# EAGLE design Adafruit_NeoMatrix_8x8 (EAGLE 6.4)
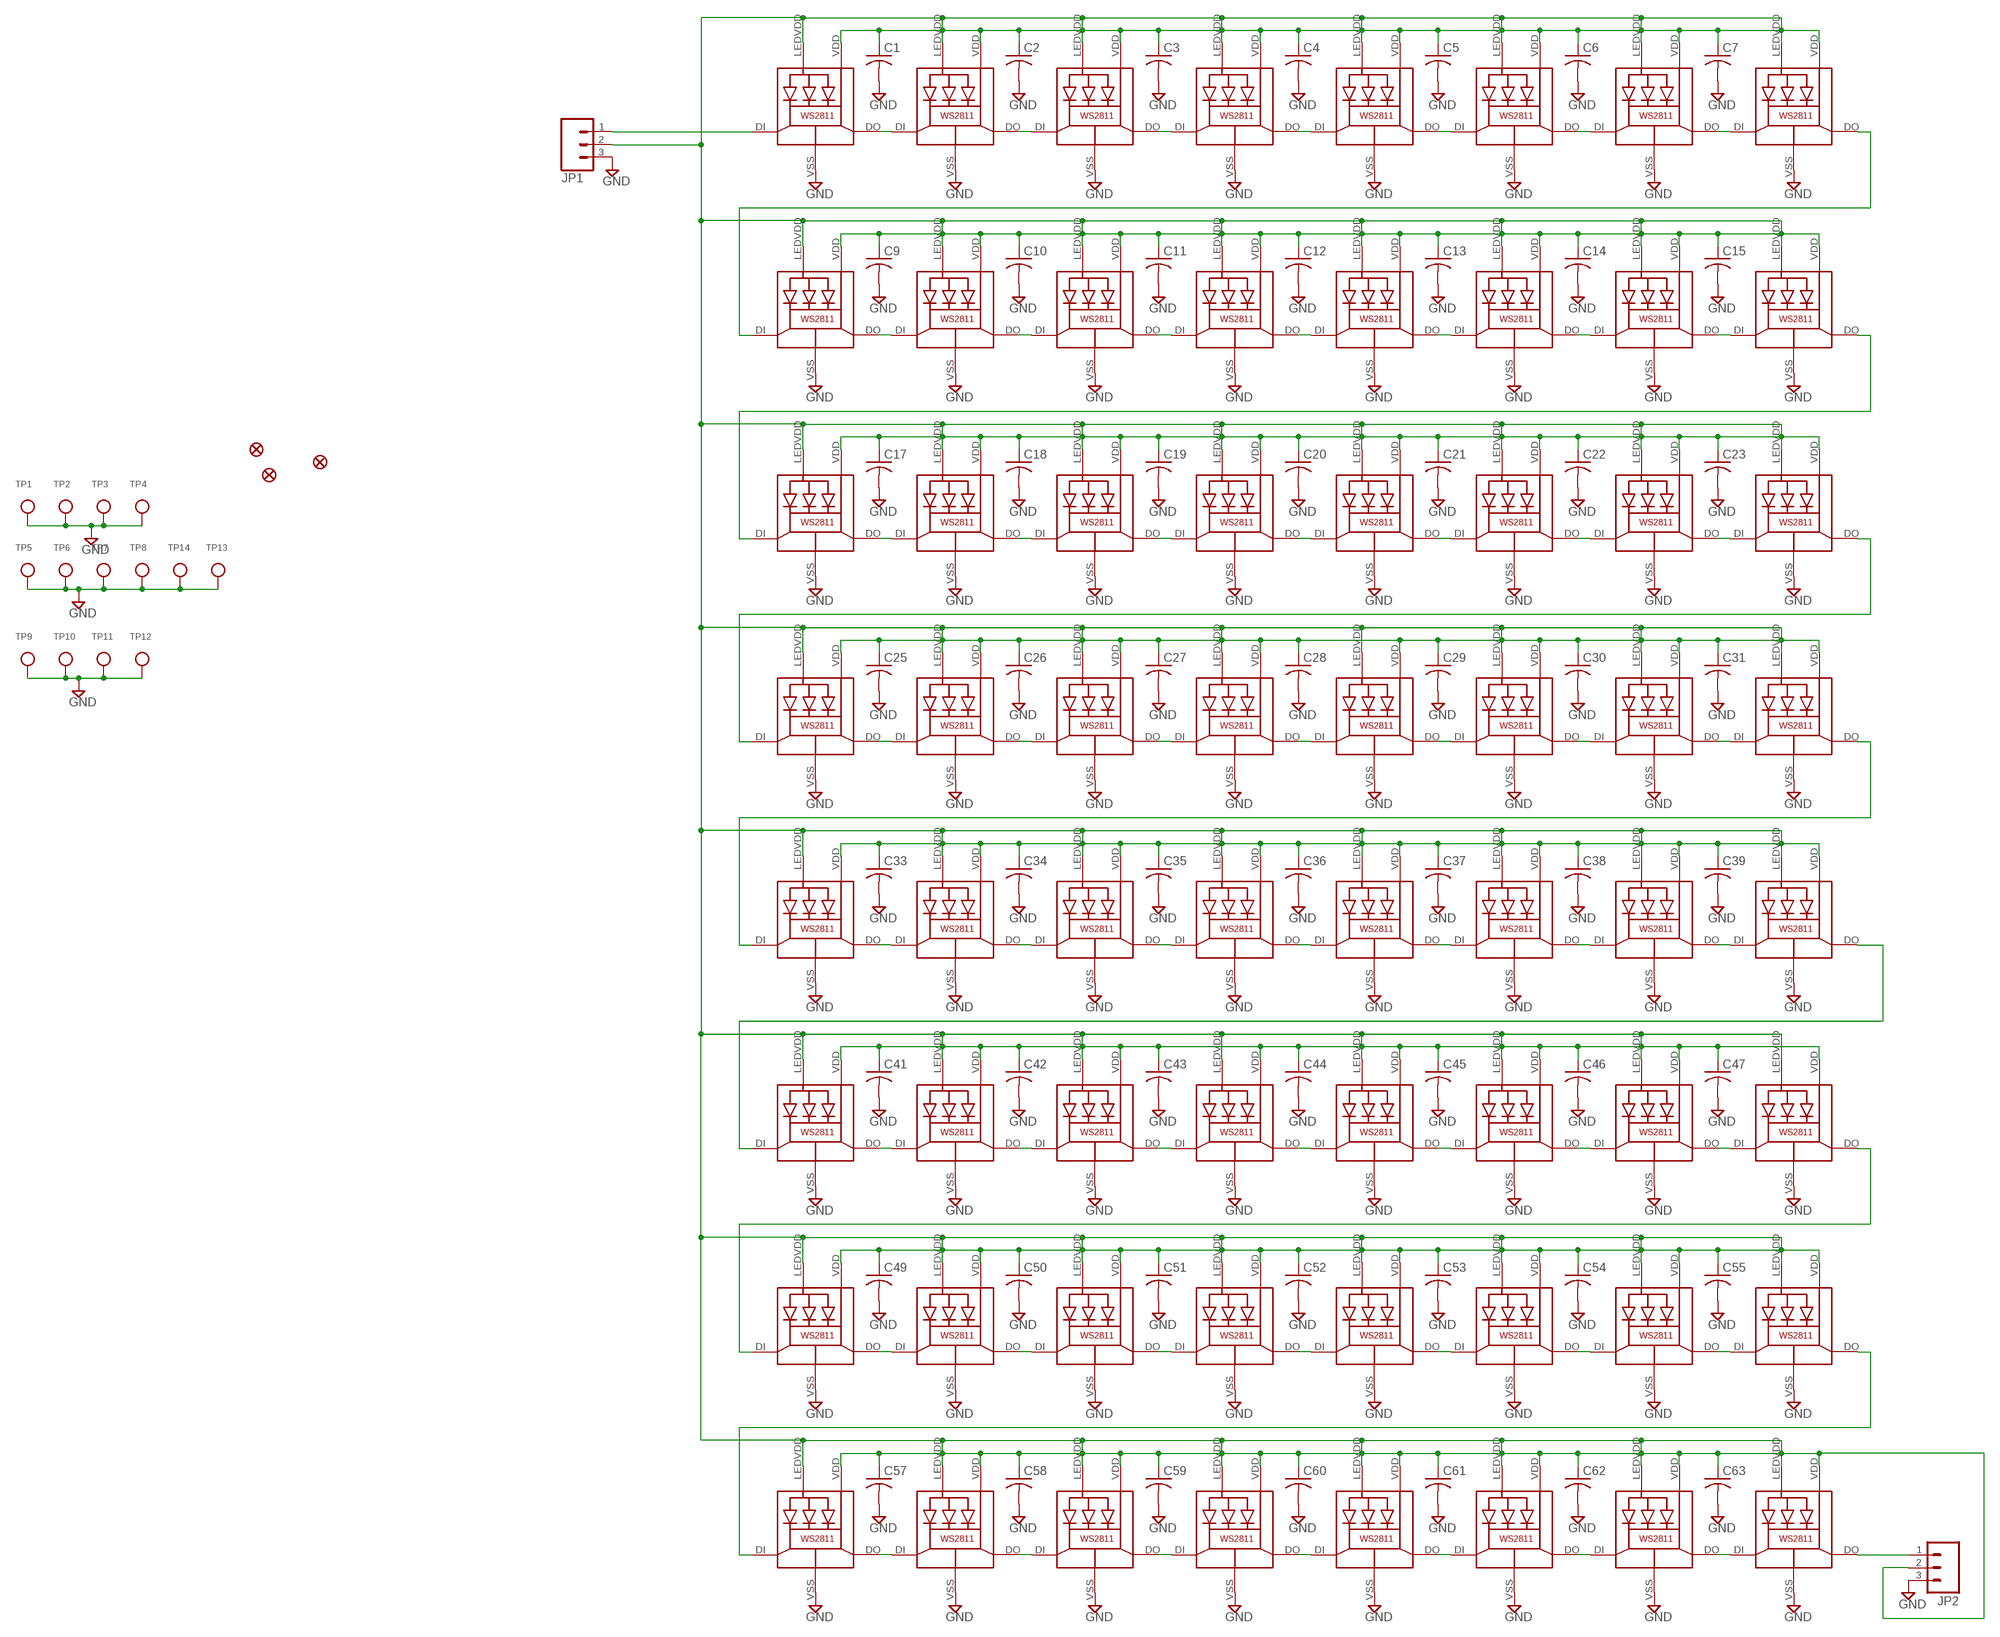
[diagram p0: schematic, sheet 1]

## Parts
C1  RCL_C-USC0805K  [RCL_C0805K]
C2  RCL_C-USC0805K  [RCL_C0805K]
C3  RCL_C-USC0805K  [RCL_C0805K]
C4  RCL_C-USC0805K  [RCL_C0805K]
C5  RCL_C-USC0805K  [RCL_C0805K]
C6  RCL_C-USC0805K  [RCL_C0805K]
C7  RCL_C-USC0805K  [RCL_C0805K]
C9  RCL_C-USC0805K  [RCL_C0805K]
C10  RCL_C-USC0805K  [RCL_C0805K]
C11  RCL_C-USC0805K  [RCL_C0805K]
C12  RCL_C-USC0805K  [RCL_C0805K]
C13  RCL_C-USC0805K  [RCL_C0805K]
C14  RCL_C-USC0805K  [RCL_C0805K]
C15  RCL_C-USC0805K  [RCL_C0805K]
C17  RCL_C-USC0805K  [RCL_C0805K]
C18  RCL_C-USC0805K  [RCL_C0805K]
C19  RCL_C-USC0805K  [RCL_C0805K]
C20  RCL_C-USC0805K  [RCL_C0805K]
C21  RCL_C-USC0805K  [RCL_C0805K]
C22  RCL_C-USC0805K  [RCL_C0805K]
C23  RCL_C-USC0805K  [RCL_C0805K]
C25  RCL_C-USC0805K  [RCL_C0805K]
C26  RCL_C-USC0805K  [RCL_C0805K]
C27  RCL_C-USC0805K  [RCL_C0805K]
C28  RCL_C-USC0805K  [RCL_C0805K]
C29  RCL_C-USC0805K  [RCL_C0805K]
C30  RCL_C-USC0805K  [RCL_C0805K]
C31  RCL_C-USC0805K  [RCL_C0805K]
C33  RCL_C-USC0805K  [RCL_C0805K]
C34  RCL_C-USC0805K  [RCL_C0805K]
C35  RCL_C-USC0805K  [RCL_C0805K]
C36  RCL_C-USC0805K  [RCL_C0805K]
C37  RCL_C-USC0805K  [RCL_C0805K]
C38  RCL_C-USC0805K  [RCL_C0805K]
C39  RCL_C-USC0805K  [RCL_C0805K]
C41  RCL_C-USC0805K  [RCL_C0805K]
C42  RCL_C-USC0805K  [RCL_C0805K]
C43  RCL_C-USC0805K  [RCL_C0805K]
C44  RCL_C-USC0805K  [RCL_C0805K]
C45  RCL_C-USC0805K  [RCL_C0805K]
C46  RCL_C-USC0805K  [RCL_C0805K]
C47  RCL_C-USC0805K  [RCL_C0805K]
C49  RCL_C-USC0805K  [RCL_C0805K]
C50  RCL_C-USC0805K  [RCL_C0805K]
C51  RCL_C-USC0805K  [RCL_C0805K]
C52  RCL_C-USC0805K  [RCL_C0805K]
C53  RCL_C-USC0805K  [RCL_C0805K]
C54  RCL_C-USC0805K  [RCL_C0805K]
C55  RCL_C-USC0805K  [RCL_C0805K]
C57  RCL_C-USC0805K  [RCL_C0805K]
C58  RCL_C-USC0805K  [RCL_C0805K]
C59  RCL_C-USC0805K  [RCL_C0805K]
C60  RCL_C-USC0805K  [RCL_C0805K]
C61  RCL_C-USC0805K  [RCL_C0805K]
C62  RCL_C-USC0805K  [RCL_C0805K]
C63  RCL_C-USC0805K  [RCL_C0805K]
FID1  FIDUCIAL""  [FIDUCIAL_1MM]
FID2  FIDUCIAL""  [FIDUCIAL_1MM]
FID3  FIDUCIAL""  [FIDUCIAL_1MM]
JP1  M03PTH  [1X03]
JP2  M03PTH  [1X03]
LED1  WS28115050  [WS28115050]
LED2  WS28115050  [WS28115050]
LED3  WS28115050  [WS28115050]
LED4  WS28115050  [WS28115050]
LED5  WS28115050  [WS28115050]
LED6  WS28115050  [WS28115050]
LED7  WS28115050  [WS28115050]
LED8  WS28115050  [WS28115050]
LED9  WS28115050  [WS28115050]
LED10  WS28115050  [WS28115050]
LED11  WS28115050  [WS28115050]
LED12  WS28115050  [WS28115050]
LED13  WS28115050  [WS28115050]
LED14  WS28115050  [WS28115050]
LED15  WS28115050  [WS28115050]
LED16  WS28115050  [WS28115050]
LED17  WS28115050  [WS28115050]
LED18  WS28115050  [WS28115050]
LED19  WS28115050  [WS28115050]
LED20  WS28115050  [WS28115050]
LED21  WS28115050  [WS28115050]
LED22  WS28115050  [WS28115050]
LED23  WS28115050  [WS28115050]
LED24  WS28115050  [WS28115050]
LED25  WS28115050  [WS28115050]
LED26  WS28115050  [WS28115050]
LED27  WS28115050  [WS28115050]
LED28  WS28115050  [WS28115050]
LED29  WS28115050  [WS28115050]
LED30  WS28115050  [WS28115050]
LED31  WS28115050  [WS28115050]
LED32  WS28115050  [WS28115050]
LED33  WS28115050  [WS28115050]
LED34  WS28115050  [WS28115050]
LED35  WS28115050  [WS28115050]
LED36  WS28115050  [WS28115050]
LED37  WS28115050  [WS28115050]
LED38  WS28115050  [WS28115050]
LED39  WS28115050  [WS28115050]
LED40  WS28115050  [WS28115050]
LED41  WS28115050  [WS28115050]
LED42  WS28115050  [WS28115050]
LED43  WS28115050  [WS28115050]
LED44  WS28115050  [WS28115050]
LED45  WS28115050  [WS28115050]
LED46  WS28115050  [WS28115050]
LED47  WS28115050  [WS28115050]
LED48  WS28115050  [WS28115050]
LED49  WS28115050  [WS28115050]
LED50  WS28115050  [WS28115050]
LED51  WS28115050  [WS28115050]
LED52  WS28115050  [WS28115050]
LED53  WS28115050  [WS28115050]
LED54  WS28115050  [WS28115050]
LED55  WS28115050  [WS28115050]
LED56  WS28115050  [WS28115050]
LED57  WS28115050  [WS28115050]
LED58  WS28115050  [WS28115050]
LED59  WS28115050  [WS28115050]
LED60  WS28115050  [WS28115050]
LED61  WS28115050  [WS28115050]
LED62  WS28115050  [WS28115050]
LED63  WS28115050  [WS28115050]
LED64  WS28115050  [WS28115050]
TP1  TESTPOINT  [TESTPOINT_SMT]
TP2  TESTPOINT  [TESTPOINT_SMT]
TP3  TESTPOINT  [TESTPOINT_SMT]
TP4  TESTPOINT  [TESTPOINT_SMT]
TP5  TESTPOINT  [TESTPOINT_SMT]
TP6  TESTPOINT  [TESTPOINT_SMT]
TP7  TESTPOINT  [TESTPOINT_SMT]
TP8  TESTPOINT  [TESTPOINT_SMT]
TP9  TESTPOINT  [TESTPOINT_SMT]
TP10  TESTPOINT  [TESTPOINT_SMT]
TP11  TESTPOINT  [TESTPOINT_SMT]
TP12  TESTPOINT  [TESTPOINT_SMT]
TP13  TESTPOINT  [TESTPOINT_SMT]
TP14  TESTPOINT  [TESTPOINT_SMT]

## Nets
GND: C1.2 C2.2 C3.2 C4.2 C5.2 C6.2 C7.2 C9.2 C10.2 C11.2 C12.2 C13.2 C14.2 C15.2 C17.2 C18.2 C19.2 C20.2 C21.2 C22.2 C23.2 C25.2 C26.2 C27.2 C28.2 C29.2 C30.2 C31.2 C33.2 C34.2 C35.2 C36.2 C37.2 C38.2 C39.2 C41.2 C42.2 C43.2 C44.2 C45.2 C46.2 C47.2 C49.2 C50.2 C51.2 C52.2 C53.2 C54.2 C55.2 C57.2 C58.2 C59.2 C60.2 C61.2 C62.2 C63.2 JP1.3 JP2.3 LED1.VSS(GND) LED2.VSS(GND) LED3.VSS(GND) LED4.VSS(GND) LED5.VSS(GND) LED6.VSS(GND) LED7.VSS(GND) LED8.VSS(GND) LED9.VSS(GND) LED10.VSS(GND) LED11.VSS(GND) LED12.VSS(GND) LED13.VSS(GND) LED14.VSS(GND) LED15.VSS(GND) LED16.VSS(GND) LED17.VSS(GND) LED18.VSS(GND) LED19.VSS(GND) LED20.VSS(GND) LED21.VSS(GND) LED22.VSS(GND) LED23.VSS(GND) LED24.VSS(GND) LED25.VSS(GND) LED26.VSS(GND) LED27.VSS(GND) LED28.VSS(GND) LED29.VSS(GND) LED30.VSS(GND) LED31.VSS(GND) LED32.VSS(GND) LED33.VSS(GND) LED34.VSS(GND) LED35.VSS(GND) LED36.VSS(GND) LED37.VSS(GND) LED38.VSS(GND) LED39.VSS(GND) LED40.VSS(GND) LED41.VSS(GND) LED42.VSS(GND) LED43.VSS(GND) LED44.VSS(GND) LED45.VSS(GND) LED46.VSS(GND) LED47.VSS(GND) LED48.VSS(GND) LED49.VSS(GND) LED50.VSS(GND) LED51.VSS(GND) LED52.VSS(GND) LED53.VSS(GND) LED54.VSS(GND) LED55.VSS(GND) LED56.VSS(GND) LED57.VSS(GND) LED58.VSS(GND) LED59.VSS(GND) LED60.VSS(GND) LED61.VSS(GND) LED62.VSS(GND) LED63.VSS(GND) LED64.VSS(GND) TP1.P$1 TP2.P$1 TP3.P$1 TP4.P$1 TP5.P$1 TP6.P$1 TP7.P$1 TP8.P$1 TP9.P$1 TP10.P$1 TP11.P$1 TP12.P$1 TP13.P$1 TP14.P$1
N$1: JP1.1 LED1.DI
N$2: LED8.DO LED9.DI
N$3: LED16.DO LED17.DI
N$4: LED24.DO LED25.DI
N$5: LED40.DO LED41.DI
N$6: LED32.DO LED33.DI
N$7: LED48.DO LED49.DI
N$8: LED56.DO LED57.DI
N$9: JP2.1 LED64.DO
N$33: LED17.DO LED18.DI
N$34: LED25.DO LED26.DI
N$35: LED26.DO LED27.DI
N$36: LED2.DO LED3.DI
N$37: LED3.DO LED4.DI
N$38: LED4.DO LED5.DI
N$39: LED5.DO LED6.DI
N$40: LED6.DO LED7.DI
N$41: LED7.DO LED8.DI
N$42: LED10.DO LED11.DI
N$43: LED11.DO LED12.DI
N$44: LED12.DO LED13.DI
N$45: LED13.DO LED14.DI
N$46: LED14.DO LED15.DI
N$47: LED15.DO LED16.DI
N$48: LED18.DO LED19.DI
N$49: LED19.DO LED20.DI
N$50: LED20.DO LED21.DI
N$51: LED21.DO LED22.DI
N$52: LED22.DO LED23.DI
N$53: LED23.DO LED24.DI
N$54: LED27.DO LED28.DI
N$55: LED28.DO LED29.DI
N$56: LED29.DO LED30.DI
N$57: LED30.DO LED31.DI
N$58: LED31.DO LED32.DI
N$59: LED1.DO LED2.DI
N$60: LED9.DO LED10.DI
N$93: LED49.DO LED50.DI
N$94: LED57.DO LED58.DI
N$95: LED58.DO LED59.DI
N$96: LED34.DO LED35.DI
N$97: LED35.DO LED36.DI
N$98: LED36.DO LED37.DI
N$99: LED37.DO LED38.DI
N$100: LED38.DO LED39.DI
N$101: LED39.DO LED40.DI
N$102: LED42.DO LED43.DI
N$103: LED43.DO LED44.DI
N$104: LED44.DO LED45.DI
N$105: LED45.DO LED46.DI
N$106: LED46.DO LED47.DI
N$107: LED47.DO LED48.DI
N$108: LED50.DO LED51.DI
N$109: LED51.DO LED52.DI
N$110: LED52.DO LED53.DI
N$111: LED53.DO LED54.DI
N$112: LED54.DO LED55.DI
N$113: LED55.DO LED56.DI
N$114: LED59.DO LED60.DI
N$115: LED60.DO LED61.DI
N$116: LED61.DO LED62.DI
N$117: LED62.DO LED63.DI
N$118: LED63.DO LED64.DI
N$119: LED33.DO LED34.DI
N$120: LED41.DO LED42.DI
VDD: C1.1 C2.1 C3.1 C4.1 C5.1 C6.1 C7.1 C9.1 C10.1 C11.1 C12.1 C13.1 C14.1 C15.1 C17.1 C18.1 C19.1 C20.1 C21.1 C22.1 C23.1 C25.1 C26.1 C27.1 C28.1 C29.1 C30.1 C31.1 C33.1 C34.1 C35.1 C36.1 C37.1 C38.1 C39.1 C41.1 C42.1 C43.1 C44.1 C45.1 C46.1 C47.1 C49.1 C50.1 C51.1 C52.1 C53.1 C54.1 C55.1 C57.1 C58.1 C59.1 C60.1 C61.1 C62.1 C63.1 JP1.2 JP2.2 LED1.LEDVDD LED1.VDD LED2.LEDVDD LED2.VDD LED3.LEDVDD LED3.VDD LED4.LEDVDD LED4.VDD LED5.LEDVDD LED5.VDD LED6.LEDVDD LED6.VDD LED7.LEDVDD LED7.VDD LED8.LEDVDD LED8.VDD LED9.LEDVDD LED9.VDD LED10.LEDVDD LED10.VDD LED11.LEDVDD LED11.VDD LED12.LEDVDD LED12.VDD LED13.LEDVDD LED13.VDD LED14.LEDVDD LED14.VDD LED15.LEDVDD LED15.VDD LED16.LEDVDD LED16.VDD LED17.LEDVDD LED17.VDD LED18.LEDVDD LED18.VDD LED19.LEDVDD LED19.VDD LED20.LEDVDD LED20.VDD LED21.LEDVDD LED21.VDD LED22.LEDVDD LED22.VDD LED23.LEDVDD LED23.VDD LED24.LEDVDD LED24.VDD LED25.LEDVDD LED25.VDD LED26.LEDVDD LED26.VDD LED27.LEDVDD LED27.VDD LED28.LEDVDD LED28.VDD LED29.LEDVDD LED29.VDD LED30.LEDVDD LED30.VDD LED31.LEDVDD LED31.VDD LED32.LEDVDD LED32.VDD LED33.LEDVDD LED33.VDD LED34.LEDVDD LED34.VDD LED35.LEDVDD LED35.VDD LED36.LEDVDD LED36.VDD LED37.LEDVDD LED37.VDD LED38.LEDVDD LED38.VDD LED39.LEDVDD LED39.VDD LED40.LEDVDD LED40.VDD LED41.LEDVDD LED41.VDD LED42.LEDVDD LED42.VDD LED43.LEDVDD LED43.VDD LED44.LEDVDD LED44.VDD LED45.LEDVDD LED45.VDD LED46.LEDVDD LED46.VDD LED47.LEDVDD LED47.VDD LED48.LEDVDD LED48.VDD LED49.LEDVDD LED49.VDD LED50.LEDVDD LED50.VDD LED51.LEDVDD LED51.VDD LED52.LEDVDD LED52.VDD LED53.LEDVDD LED53.VDD LED54.LEDVDD LED54.VDD LED55.LEDVDD LED55.VDD LED56.LEDVDD LED56.VDD LED57.LEDVDD LED57.VDD LED58.LEDVDD LED58.VDD LED59.LEDVDD LED59.VDD LED60.LEDVDD LED60.VDD LED61.LEDVDD LED61.VDD LED62.LEDVDD LED62.VDD LED63.LEDVDD LED63.VDD LED64.LEDVDD LED64.VDD

## Library data of the parts
C1-C7 C9-C15 C17-C23 C25-C31 C33-C39 C41-C47 C49-C55 C57-C63 = neomatrix-8x8:RCL_C-US: CAPACITOR, American symbol
FID1-FID3 = microbuilder:FIDUCIAL: Fiducial Alignment Points Various fiducial points for machine vision alignment.; BOM: EXCLUDE
JP1 JP2 = neomatrix-8x8:M03: Header 3 Standard 3-pin 0.1" header. Use with straight break away headers (SKU : PRT-00116), right angle break away headers (PRT-00553), swiss pins (PRT-00743), machine pins (PRT-00117), and female headers (PRT-00115). Molex polarized connector foot print use with SKU : PRT-08232 with associated crimp pins and housings.
LED1-LED64 = neomatrix-8x8:WS28115050
TP1-TP14 = microbuilder:TESTPOINT: Test Point Various test points for characterisation and PCB testing TESTPOINT_SMT - Compact Surface Mount Test Point [Digikey: 5016KTR-ND]

## Board
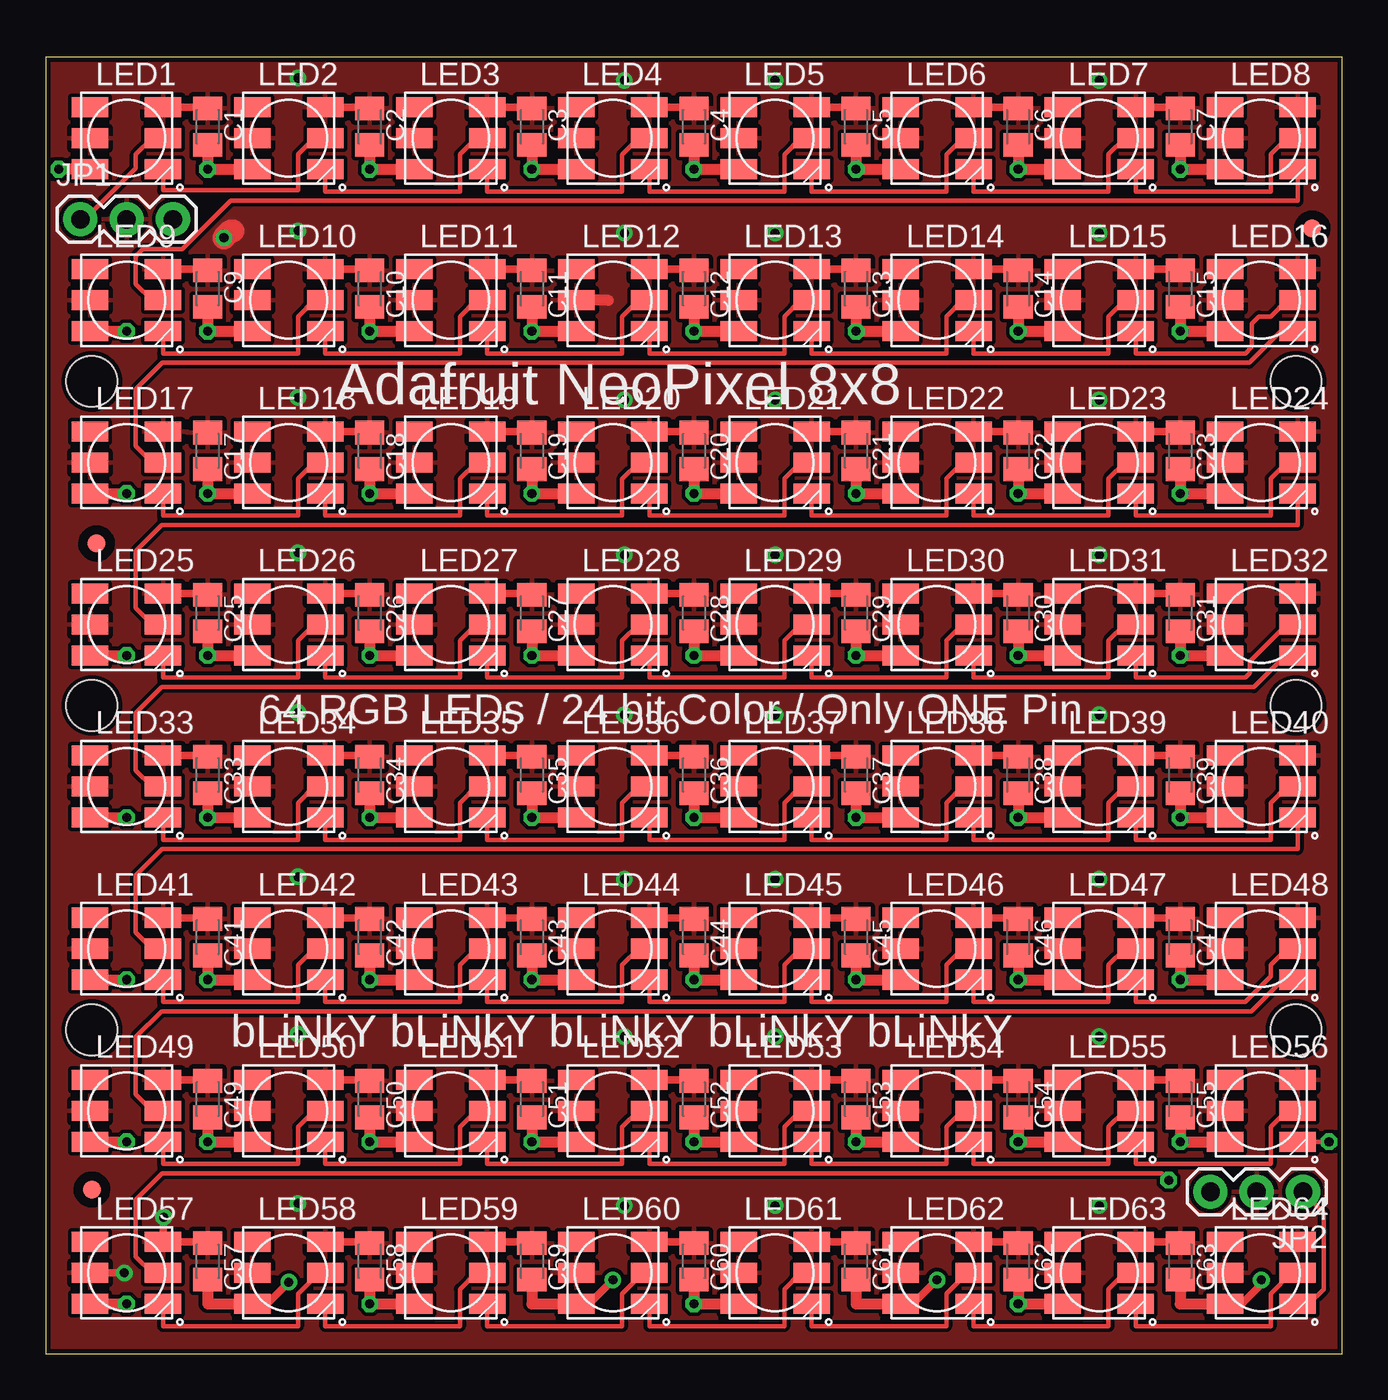
[diagram p1: board, top side]
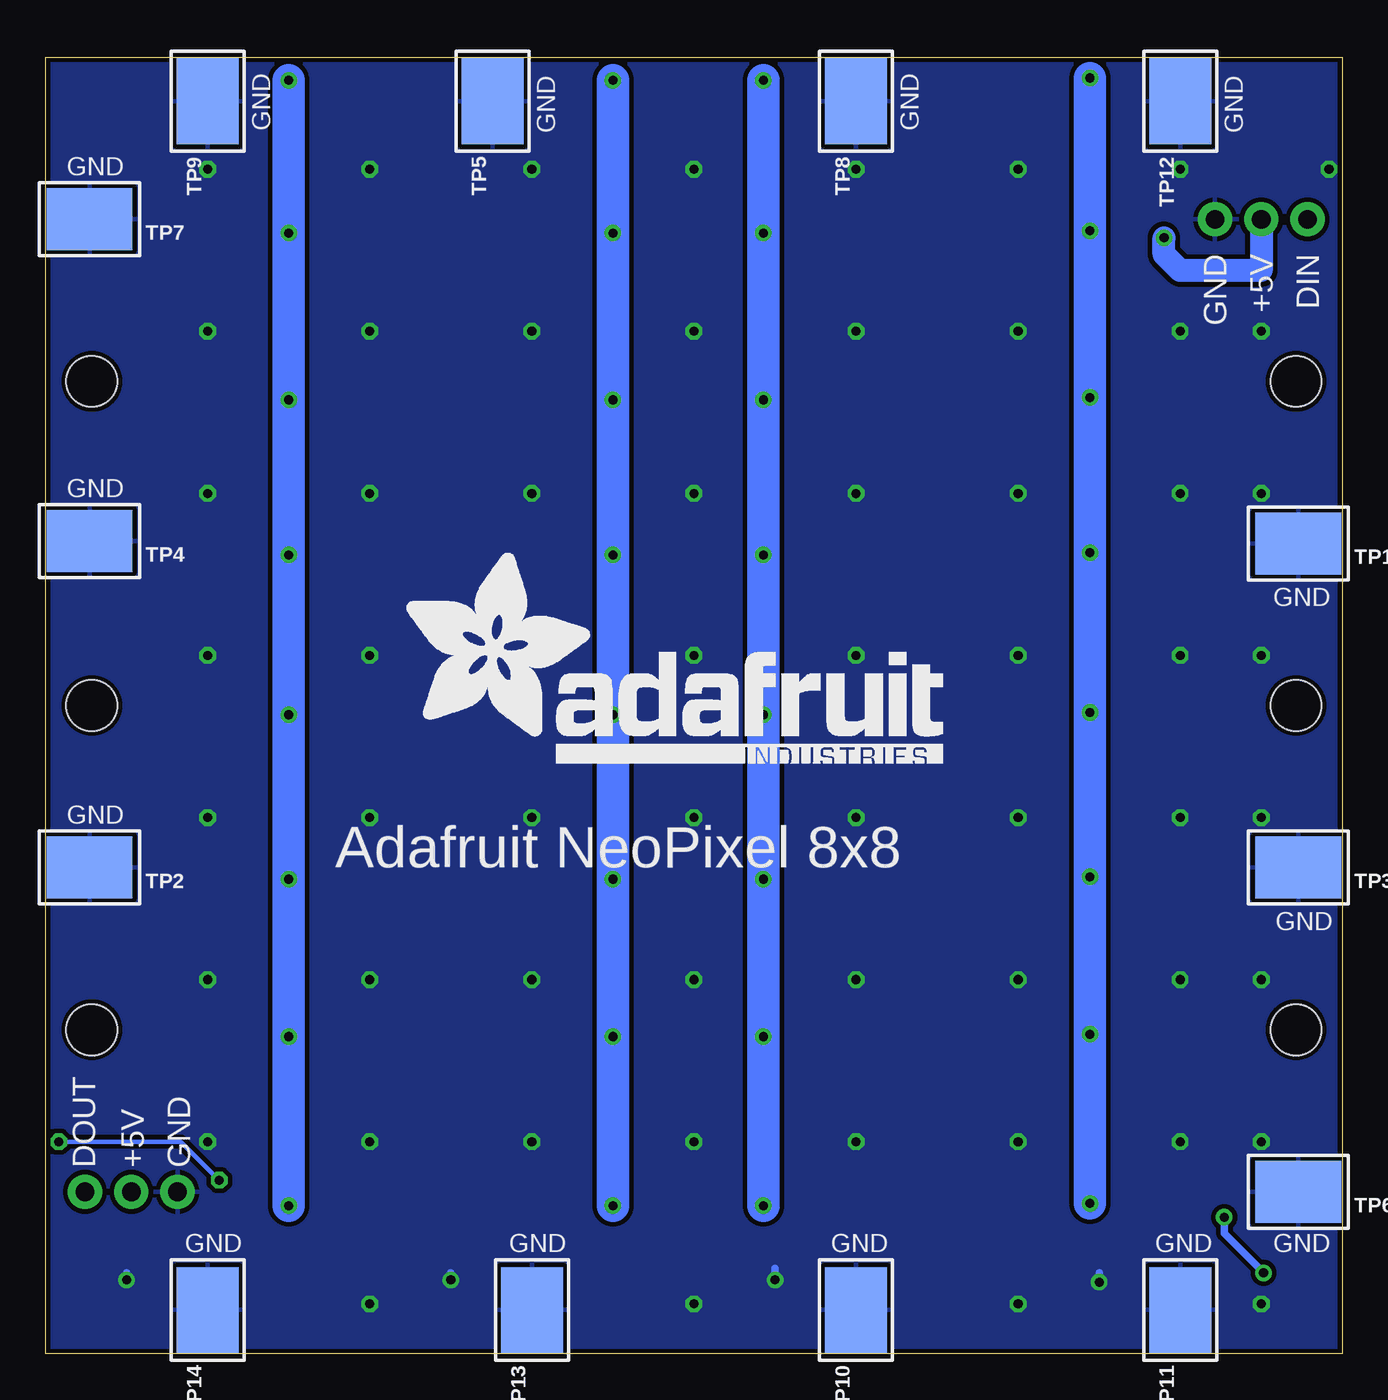
[diagram p2: board, bottom side, seen from below]

Size 71.12 x 71.12 mm. Coordinates in mm from the lower left corner, seen from the top.
Outline: 0,0 71.12,0 71.12,71.12 0,71.12 0,0
Copper layers (1*16): Top 0.035mm / dielectric 1.5mm / Bottom 0.035mm
Design rules "adafruit_rules_1": minimum track width 8mil, minimum drill 15.5mil, track to track 8mil, track to pad 8mil, pad to pad 8mil, via to via 8mil, smd to smd 8mil, copper to edge 10mil, drill to drill 8mil, minimum pad ring 10mil, minimum via ring 8mil, stop-mask expansion 4mil, vias tented up to drill 25mil, thermal gap 10mil
Holes 2.8 mm at 2.54,53.34 68.58,53.34 2.54,17.78 68.58,17.78 2.54,35.56 68.58,35.56

### Footprints (pad centres in the part's own frame; a part is rotated, then mirrored left to right if it is on the bottom)
RCL_C0805K = smd 1.3 x 1.6: 1 -1,0; 2 1,0
FIDUCIAL_1MM = smd 1 x 1: 1 0,0
1X03 = drill 1.016 pad 1.88: 1 0,0; 2 2.54,0; 3 5.08,0
WS28115050 = smd 2 x 1.1: DI 2,0; DO 2,-1.7; LEDVDD -2,0; NC -2,1.7; VDD 2,1.7; VSS -2,-1.7
TESTPOINT_SMT = smd 4.7 x 3.4: P$1 0,0

### Placement (x,y rotation side)
C1  8.89,67.31 270 top
C2  17.78,67.31 270 top
C3  26.67,67.31 270 top
C4  35.56,67.31 270 top
C5  44.45,67.31 270 top
C6  53.34,67.31 270 top
C7  62.23,67.31 270 top
C9  8.89,58.42 270 top
C10  17.78,58.42 270 top
C11  26.67,58.42 270 top
C12  35.56,58.42 270 top
C13  44.45,58.42 270 top
C14  53.34,58.42 270 top
C15  62.23,58.42 270 top
C17  8.89,49.53 270 top
C18  17.78,49.53 270 top
C19  26.67,49.53 270 top
C20  35.56,49.53 270 top
C21  44.45,49.53 270 top
C22  53.34,49.53 270 top
C23  62.23,49.53 270 top
C25  8.89,40.64 270 top
C26  17.78,40.64 270 top
C27  26.67,40.64 270 top
C28  35.56,40.64 270 top
C29  44.45,40.64 270 top
C30  53.34,40.64 270 top
C31  62.23,40.64 270 top
C33  8.89,31.75 270 top
C34  17.78,31.75 270 top
C35  26.67,31.75 270 top
C36  35.56,31.75 270 top
C37  44.45,31.75 270 top
C38  53.34,31.75 270 top
C39  62.23,31.75 270 top
C41  8.89,22.86 270 top
C42  17.78,22.86 270 top
C43  26.67,22.86 270 top
C44  35.56,22.86 270 top
C45  44.45,22.86 270 top
C46  53.34,22.86 270 top
C47  62.23,22.86 270 top
C49  8.89,13.97 270 top
C50  17.78,13.97 270 top
C51  26.67,13.97 270 top
C52  35.56,13.97 270 top
C53  44.45,13.97 270 top
C54  53.34,13.97 270 top
C55  62.23,13.97 270 top
C57  8.89,5.08 270 top
C58  17.78,5.08 270 top
C59  26.67,5.08 270 top
C60  35.56,5.08 270 top
C61  44.45,5.08 270 top
C62  53.34,5.08 270 top
C63  62.23,5.08 270 top
FID1  69.47,61.72 0 top
FID2  2.79,44.45 0 top
FID3  2.54,9.02 0 top
JP1  1.91,62.23 0 top
JP2  68.96,8.89 180 top
LED1  4.45,66.67 0 top
LED2  13.34,66.67 0 top
LED3  22.23,66.67 0 top
LED4  31.12,66.67 0 top
LED5  40.01,66.67 0 top
LED6  48.9,66.67 0 top
LED7  57.79,66.67 0 top
LED8  66.67,66.67 0 top
LED9  4.45,57.79 0 top
LED10  13.34,57.79 0 top
LED11  22.23,57.79 0 top
LED12  31.12,57.79 0 top
LED13  40.01,57.79 0 top
LED14  48.9,57.79 0 top
LED15  57.79,57.79 0 top
LED16  66.67,57.79 0 top
LED17  4.45,48.9 0 top
LED18  13.34,48.9 0 top
LED19  22.23,48.9 0 top
LED20  31.12,48.9 0 top
LED21  40.01,48.9 0 top
LED22  48.9,48.9 0 top
LED23  57.79,48.9 0 top
LED24  66.67,48.9 0 top
LED25  4.45,40.01 0 top
LED26  13.34,40.01 0 top
LED27  22.23,40.01 0 top
LED28  31.12,40.01 0 top
LED29  40.01,40.01 0 top
LED30  48.9,40.01 0 top
LED31  57.79,40.01 0 top
LED32  66.67,40.01 0 top
LED33  4.45,31.12 0 top
LED34  13.34,31.12 0 top
LED35  22.23,31.12 0 top
LED36  31.12,31.12 0 top
LED37  40.01,31.12 0 top
LED38  48.9,31.12 0 top
LED39  57.79,31.12 0 top
LED40  66.67,31.12 0 top
LED41  4.45,22.23 0 top
LED42  13.34,22.23 0 top
LED43  22.23,22.23 0 top
LED44  31.12,22.23 0 top
LED45  40.01,22.23 0 top
LED46  48.9,22.23 0 top
LED47  57.79,22.23 0 top
LED48  66.67,22.23 0 top
LED49  4.45,13.34 0 top
LED50  13.34,13.34 0 top
LED51  22.23,13.34 0 top
LED52  31.12,13.34 0 top
LED53  40.01,13.34 0 top
LED54  48.9,13.34 0 top
LED55  57.79,13.34 0 top
LED56  66.67,13.34 0 top
LED57  4.45,4.45 0 top
LED58  13.34,4.45 0 top
LED59  22.23,4.45 0 top
LED60  31.12,4.45 0 top
LED61  40.01,4.45 0 top
LED62  48.9,4.45 0 top
LED63  57.79,4.45 0 top
LED64  66.67,4.45 0 top
TP1  2.41,44.45 0 bottom
TP2  68.71,26.67 0 bottom
TP3  2.41,26.67 0 bottom
TP4  68.71,44.58 0 bottom
TP5  46.61,68.71 270 bottom
TP6  2.41,8.89 0 bottom
TP7  68.71,62.23 0 bottom
TP8  26.67,68.71 270 bottom
TP9  62.23,68.71 270 bottom
TP10  26.67,2.41 270 bottom
TP11  8.89,2.41 270 bottom
TP12  8.89,68.71 270 bottom
TP13  44.45,2.41 270 bottom
TP14  62.23,2.41 270 bottom
U$1  [ADAFRUIT_TEXT_30MM]  51.56,32.39 0 bottom

### Tracks (layer width: path | path; a pad name or v marks a point on that pad's centre or on a via)
GND  (via drill 0.5)
  Top 0.406: LED58.VSS 12.14,2.75 v13.34,3.94 | LED60.VSS 29.8,2.75 v31.12,4.06 | LED62.VSS 47.58,2.75 v48.9,4.06 | LED64.VSS 65.61,2.75 66.67,3.81 v66.67,4.06
  Top 0.61: LED57.VSS v4.45,2.75 | LED58.VSS 8.89,2.75 C57.2 | LED59.VSS v17.78,2.75 C58.2 | C59.2 26.67,2.75 LED60.VSS | C60.2 v35.56,2.75 LED61.VSS | C61.2 44.45,2.75 LED62.VSS | C62.2 v53.34,2.75 LED63.VSS | C63.2 62.23,2.75 LED64.VSS | C55.2 v62.23,11.64 LED56.VSS | C54.2 v53.34,11.64 LED55.VSS | C53.2 v44.45,11.64 LED54.VSS | C52.2 v35.56,11.64 LED53.VSS | LED49.VSS v4.45,11.64 | C49.2 v8.89,11.64 LED50.VSS | C50.2 v17.78,11.64 LED51.VSS | C51.2 v26.67,11.64 LED52.VSS | LED41.VSS v4.45,20.53 | C41.2 v8.89,20.53 LED42.VSS | C42.2 v17.78,20.53 LED43.VSS | C43.2 v26.67,20.53 LED44.VSS | C44.2 v35.56,20.53 LED45.VSS | C45.2 v44.45,20.53 LED46.VSS | C46.2 v53.34,20.53 LED47.VSS | C47.2 v62.23,20.53 LED48.VSS | C39.2 v62.23,29.42 LED40.VSS | C38.2 v53.34,29.42 LED39.VSS | C37.2 v44.45,29.42 LED38.VSS | C36.2 v35.56,29.42 LED37.VSS | C35.2 v26.67,29.42 LED36.VSS | C34.2 v17.78,29.42 LED35.VSS | C33.2 v8.89,29.42 LED34.VSS | C25.2 v8.89,38.3 LED26.VSS | C26.2 v17.78,38.3 LED27.VSS | LED25.VSS v4.45,38.3 | LED33.VSS v4.45,29.42 | C27.2 v26.67,38.3 LED28.VSS | C28.2 v35.56,38.3 LED29.VSS | C29.2 v44.45,38.3 LED30.VSS | C30.2 v53.34,38.3 LED31.VSS | C31.2 v62.23,38.3 LED32.VSS | C7.2 v62.23,64.97 LED8.VSS | C15.2 v62.23,56.09 LED16.VSS | C23.2 v62.23,47.2 LED24.VSS | C6.2 v53.34,64.97 LED7.VSS | C14.2 v53.34,56.09 LED15.VSS | C22.2 v53.34,47.2 LED23.VSS | C12.2 v35.56,56.09 LED13.VSS | C11.2 v26.67,56.09 LED12.VSS | C3.2 v26.67,64.97 LED4.VSS | C4.2 v35.56,64.97 LED5.VSS | C5.2 v44.45,64.97 LED6.VSS | C13.2 v44.45,56.09 LED14.VSS | C19.2 v26.67,47.2 LED20.VSS | C20.2 v35.56,47.2 LED21.VSS | C21.2 v44.45,47.2 LED22.VSS | LED1.VSS v0.73,64.97 | LED9.VSS v4.45,56.09
  Top 0.61: LED17.VSS v4.45,47.2 | C1.2 v8.89,64.97 LED2.VSS | C9.2 v8.89,56.09 LED10.VSS | C17.2 v8.89,47.2 LED18.VSS | C2.2 v17.78,64.97 LED3.VSS | C10.2 v17.78,56.09 LED11.VSS | C18.2 v17.78,47.2 LED19.VSS
  Bottom 0.406: v13.34,3.94 13.34,4.45 | v31.12,4.06 31.12,4.7 | v48.9,4.06 48.9,4.45 | v66.67,4.06 66.67,4.45
  pour Bottom (isolate 0.254): 0,0 71.12,0 71.12,71.12 0,71.12
N$1
  Top 0.254: JP1.1 2.16,62.23 4.95,65.02 4.95,65.79 5.84,66.67 LED1.DI
N$2
  Top 0.254: LED9.DI 5.84,57.79 4.95,58.67 4.95,60.2 5.33,60.58 7.49,60.58 10.16,63.25 68.68,63.25 LED8.DO
N$3
  Top 0.254: LED17.DI 5.84,48.9 4.95,49.78 4.95,52.91 6.4,54.36 66.01,54.36 67.74,56.09 LED16.DO
N$4
  Top 0.254: LED24.DO 68.68,45.47 6.37,45.47 4.95,44.05 4.95,40.89 5.84,40.01 LED25.DI
N$5
  Top 0.254: LED40.DO 68.68,27.69 6.4,27.69 4.95,26.24 4.95,23.11 5.84,22.23 LED41.DI
N$6
  Top 0.254: LED33.DI 5.84,31.12 4.95,32 4.95,35.16 6.37,36.58 66.26,36.58 67.99,38.3 LED32.DO
N$7
  Top 0.254: LED49.DI 5.84,13.34 4.95,14.22 4.95,17.38 6.37,18.8 66.14,18.8 67.86,20.53 LED48.DO
N$8  (via drill 0.5)
  Top 0.254: LED57.DI 5.84,4.45 4.95,5.33 4.95,8.46 6.4,9.91 61.21,9.91 v61.59,9.53 | v70.39,11.64 LED56.DO
  Bottom 0.254: v61.59,9.53 63.7,11.64 v70.39,11.64
N$9
  Top 0.254: LED64.DO 69.29,2.75 70.1,3.56 70.1,7.75 JP2.1
N$33
  Top 0.254: LED18.DI 14.74,48.9 13.84,48 13.84,45.97 6.45,45.97 LED17.DO
N$34
  Top 0.254: LED26.DI 14.73,40.01 13.84,39.12 13.84,37.08 6.45,37.08 LED25.DO
N$35
  Top 0.254: LED27.DI 23.62,40.01 22.73,39.12 22.73,37.08 15.34,37.08 LED26.DO
N$36
  Top 0.254: LED2.DO 15.34,63.75 22.73,63.75 22.73,65.79 23.62,66.67 LED3.DI
N$37
  Top 0.254: LED3.DO 24.23,63.75 31.62,63.75 31.62,65.78 32.52,66.67 LED4.DI
N$38
  Top 0.254: LED5.DI 41.41,66.67 40.51,65.78 40.51,63.75 33.12,63.75 LED4.DO
N$39
  Top 0.254: LED5.DO 42.01,63.75 49.4,63.75 49.4,65.78 50.3,66.67 LED6.DI
N$40
  Top 0.254: LED6.DO 50.9,63.75 58.29,63.75 58.29,65.79 59.18,66.67 LED7.DI
N$41
  Top 0.254: LED7.DO 59.79,63.75 67.18,63.75 67.18,65.79 68.07,66.67 LED8.DI
N$42
  Top 0.254: LED10.DO 15.34,54.86 22.73,54.86 22.73,56.9 23.62,57.79 LED11.DI
N$43
  Top 0.254: LED12.DI 32.51,57.79 31.62,56.9 31.62,54.86 24.23,54.86 LED11.DO
N$44
  Top 0.254: LED12.DO 33.12,54.86 40.51,54.86 40.51,56.9 41.4,57.79 LED13.DI
N$45
  Top 0.254: LED13.DO 42.01,54.86 49.4,54.86 49.4,56.9 50.29,57.79 LED14.DI
N$46
  Top 0.254: LED14.DO 50.9,54.86 58.29,54.86 58.29,56.9 59.18,57.79 LED15.DI
N$47
  Top 0.254: LED15.DO 59.79,54.86 65.79,54.86 66.17,55.25 66.17,56.52 66.55,56.9 67.18,56.9 68.07,57.79 LED16.DI
N$48
  Top 0.254: LED19.DI 23.63,48.9 22.73,48 22.73,45.97 15.34,45.97 LED18.DO
N$49
  Top 0.254: LED20.DI 32.55,48.9 31.62,47.97 31.62,45.97 24.23,45.97 LED19.DO
N$50
  Top 0.254: LED21.DI 41.41,48.9 40.51,48 40.51,45.97 33.12,45.97 LED20.DO
N$51
  Top 0.254: LED22.DI 50.29,48.9 49.4,48.01 49.4,45.97 42.01,45.97 LED21.DO
N$52
  Top 0.254: LED23.DI 59.19,48.9 58.29,48 58.29,45.97 50.9,45.97 LED22.DO
N$53
  Top 0.254: LED24.DI 68.07,48.9 67.18,48.01 67.18,45.97 59.79,45.97 LED23.DO
N$54
  Top 0.254: LED28.DI 32.51,40.01 31.62,39.12 31.62,37.08 24.23,37.08 LED27.DO
N$55
  Top 0.254: LED29.DI 41.4,40.01 40.51,39.12 40.51,37.08 33.12,37.08 LED28.DO
N$56
  Top 0.254: LED30.DI 50.29,40.01 49.4,39.12 49.4,37.08 42.01,37.08 LED29.DO
N$57
  Top 0.254: LED31.DI 59.18,40.01 58.29,39.12 58.29,37.08 50.9,37.08 LED30.DO
N$58
  Top 0.254: LED32.DI 68.07,40.01 66.04,37.97 66.04,37.34 65.79,37.08 59.79,37.08 LED31.DO
N$59
  Top 0.254: LED1.DO 6.45,63.82 13.84,63.82 13.84,65.79 14.73,66.67 LED2.DI
N$60
  Top 0.254: LED9.DO 6.45,54.86 13.84,54.86 13.84,56.89 14.74,57.79 LED10.DI
N$93
  Top 0.254: LED50.DI 14.73,13.34 13.84,12.45 13.84,10.41 6.45,10.41 LED49.DO
N$94
  Top 0.254: LED58.DI 15,4.45 13.84,3.29 13.84,1.52 6.45,1.52 LED57.DO
N$95
  Top 0.254: LED59.DI 23.62,4.45 22.73,3.56 22.73,1.52 15.34,1.52 LED58.DO
N$96
  Top 0.254: LED35.DI 23.62,31.12 22.73,30.23 22.73,28.19 15.34,28.19 LED34.DO
N$97
  Top 0.254: LED36.DI 32.51,31.12 31.62,30.23 31.62,28.19 24.23,28.19 LED35.DO
N$98
  Top 0.254: LED37.DI 41.4,31.12 40.51,30.23 40.51,28.19 33.12,28.19 LED36.DO
N$99
  Top 0.254: LED38.DI 50.29,31.12 49.4,30.23 49.4,28.19 42.01,28.19 LED37.DO
N$100
  Top 0.254: LED39.DI 59.18,31.12 58.29,30.23 58.29,28.19 50.9,28.19 LED38.DO
N$101
  Top 0.254: LED40.DI 68.07,31.12 67.18,30.23 67.18,28.19 59.79,28.19 LED39.DO
N$102
  Top 0.254: LED43.DI 23.62,22.23 22.73,21.34 22.73,19.3 15.34,19.3 LED42.DO
N$103
  Top 0.254: LED44.DI 32.51,22.23 31.62,21.34 31.62,19.3 24.23,19.3 LED43.DO
N$104
  Top 0.254: LED45.DI 41.4,22.23 40.51,21.34 40.51,19.3 33.12,19.3 LED44.DO
N$105
  Top 0.254: LED46.DI 50.29,22.23 49.4,21.34 49.4,19.3 42.01,19.3 LED45.DO
N$106
  Top 0.254: LED47.DI 59.18,22.23 58.29,21.34 58.29,19.3 50.9,19.3 LED46.DO
N$107
  Top 0.254: LED48.DI 68.07,22.23 67.18,21.34 67.18,20.7 65.79,19.3 59.79,19.3 LED47.DO
N$108
  Top 0.254: LED51.DI 23.62,13.34 22.73,12.45 22.73,10.41 15.34,10.41 LED50.DO
N$109
  Top 0.254: LED52.DI 32.51,13.34 31.62,12.45 31.62,10.41 24.23,10.41 LED51.DO
N$110
  Top 0.254: LED53.DI 41.4,13.34 40.51,12.45 40.51,10.41 33.12,10.41 LED52.DO
N$111
  Top 0.254: LED54.DI 50.29,13.34 49.4,12.45 49.4,10.41 42.01,10.41 LED53.DO
N$112
  Top 0.254: LED55.DI 59.18,13.34 58.29,12.45 58.29,10.41 50.9,10.41 LED54.DO
N$113
  Top 0.254: LED56.DI 68.07,13.34 67.18,12.45 67.18,10.41 59.79,10.41 LED55.DO
N$114
  Top 0.254: LED60.DI 32.77,4.45 31.62,3.3 31.62,1.52 24.23,1.52 LED59.DO
N$115
  Top 0.254: LED61.DI 41.4,4.45 40.51,3.56 40.51,1.52 33.12,1.52 LED60.DO
N$116
  Top 0.254: LED62.DI 50.55,4.45 49.4,3.3 49.4,1.52 42.01,1.52 LED61.DO
N$117
  Top 0.254: LED63.DI 59.18,4.45 58.29,3.56 58.29,1.52 50.9,1.52 LED62.DO
N$118
  Top 0.254: LED64.DI 68.33,4.45 67.18,3.3 67.18,1.52 59.79,1.52 LED63.DO
N$119
  Top 0.254: LED34.DI 14.73,31.12 13.84,30.23 13.84,28.19 6.45,28.19 LED33.DO
N$120
  Top 0.254: LED42.DI 14.73,22.23 13.84,21.34 13.84,19.3 6.45,19.3 LED41.DO
VDD  (via drill 0.5)
  Top 0.406: C57.1 8.89,6.15 LED57.VDD 6.45,7.46 v6.48,7.49 | LED63.VDD 62.23,6.15 C63.1 | LED62.VDD 53.34,6.15 C62.1 | LED61.VDD 44.45,6.15 C61.1 | LED60.VDD 35.56,6.15 C60.1 | LED59.VDD 26.67,6.15 C59.1 | LED58.VDD 17.78,6.15 C58.1 | LED49.VDD 8.89,15.04 C49.1 | LED50.VDD 17.78,15.04 C50.1 | LED51.VDD 26.67,15.04 C51.1 | LED52.VDD 35.56,15.04 C52.1 | LED53.VDD 44.45,15.04 C53.1 | LED54.VDD 53.34,15.04 C54.1 | LED55.VDD 62.23,15.04 C55.1 | LED41.VDD 8.89,23.93 C41.1 | LED42.VDD 17.78,23.93 C42.1 | LED43.VDD 26.67,23.93 C43.1 | LED44.VDD 35.56,23.93 C44.1 | LED45.VDD 44.45,23.93 C45.1 | LED46.VDD 53.34,23.93 C46.1 | LED47.VDD 62.23,23.93 C47.1 | LED33.VDD 8.89,32.82 C33.1 | LED34.VDD 17.78,32.82 C34.1 | LED35.VDD 26.67,32.82 C35.1 | LED36.VDD 35.56,32.82 C36.1 | LED37.VDD 44.45,32.82 C37.1 | LED38.VDD 53.34,32.82 C38.1 | LED39.VDD 62.23,32.82 C39.1 | LED25.VDD 8.89,41.7 C25.1 | LED26.VDD 17.78,41.7 C26.1 | LED27.VDD 26.67,41.7 C27.1 | LED28.VDD 35.56,41.7 C28.1 | LED29.VDD 44.45,41.7 C29.1 | LED30.VDD 53.34,41.7 C30.1 | LED31.VDD 62.23,41.7 C31.1 | LED1.VDD 8.89,68.38 C1.1 | LED2.VDD 17.78,68.38 C2.1 | LED3.VDD 26.67,68.38 C3.1 | LED4.VDD 35.56,68.38 C4.1 | LED5.VDD 44.45,68.38 C5.1 | LED6.VDD 53.34,68.38 C6.1 | LED7.VDD 62.23,68.38 C7.1 | LED9.VDD 8.89,59.48 C9.1 | LED10.VDD 17.78,59.48 C10.1 | LED11.VDD 26.67,59.48 C11.1 | LED12.VDD 35.56,59.48 C12.1 | LED13.VDD 44.45,59.48 C13.1 | LED14.VDD 53.34,59.48 C14.1 | LED15.VDD 62.23,59.48 C15.1 | LED18.VDD 17.78,50.59 C18.1 | LED19.VDD 26.67,50.59 C19.1 | LED20.VDD 35.56,50.59 C20.1 | LED21.VDD 44.45,50.59 C21.1 | LED22.VDD 53.34,50.59 C22.1 | LED23.VDD 62.23,50.59 C23.1 | LED58.LEDVDD 12.07,4.45 | LED57.LEDVDD v4.32,4.45
  Top 0.61: 30.86,57.79 LED12.LEDVDD
  Top 1.27: v9.78,61.21 10.16,61.59 10.29,61.59
  Bottom 0.406: v4.32,4.45 6.48,6.6 v6.48,7.49
  Bottom 1.27: JP1.2 4.45,59.42 C9.1 9.78,60.31 v9.78,61.21
  Bottom 1.778: v40.01,8.13 v40.01,17.4 v40.01,26.04 v40.01,35.05 v40.01,43.82 v40.01,52.32 v40.01,61.47 v40.01,69.85 | v31.75,8.13 v31.75,17.4 v31.75,26.04 v31.75,35.05 v31.75,43.82 v31.75,52.32 v31.75,61.47 v31.75,69.85 | v57.79,8.13 v57.79,17.4 v57.79,26.04 v57.79,35.05 v57.79,43.82 v57.79,52.32 v57.79,61.47 v57.79,69.85 | v13.84,8.26 v13.84,17.53 v13.84,26.16 v13.84,35.18 v13.84,43.94 v13.84,52.45 v13.84,61.59 v13.84,69.98
  pour Top: 0,71.12 0,0 71.12,0 71.12,71.12

### Text on the board
tPlace: Adafruit NeoPixel 8x8 | 64 RGB LEDs / 24 bit Color / Only ONE Pin | bLiNkY bLiNkY bLiNkY bLiNkY bLiNkY
bPlace: GND | GND | GND | GND | GND | DIN | +5V | GND | GND | GND | GND | Adafruit NeoPixel 8x8 | GND | GND | +5V | DOUT | GND | GND | GND | GND | GND